# EasyEDA schematic Geiger counter.json
TITLE: Sheet_1; REV: 1.0; Date: 2019-12-27; Sheet: 1/1; Drawn By: bananatrek; Company: Your Company
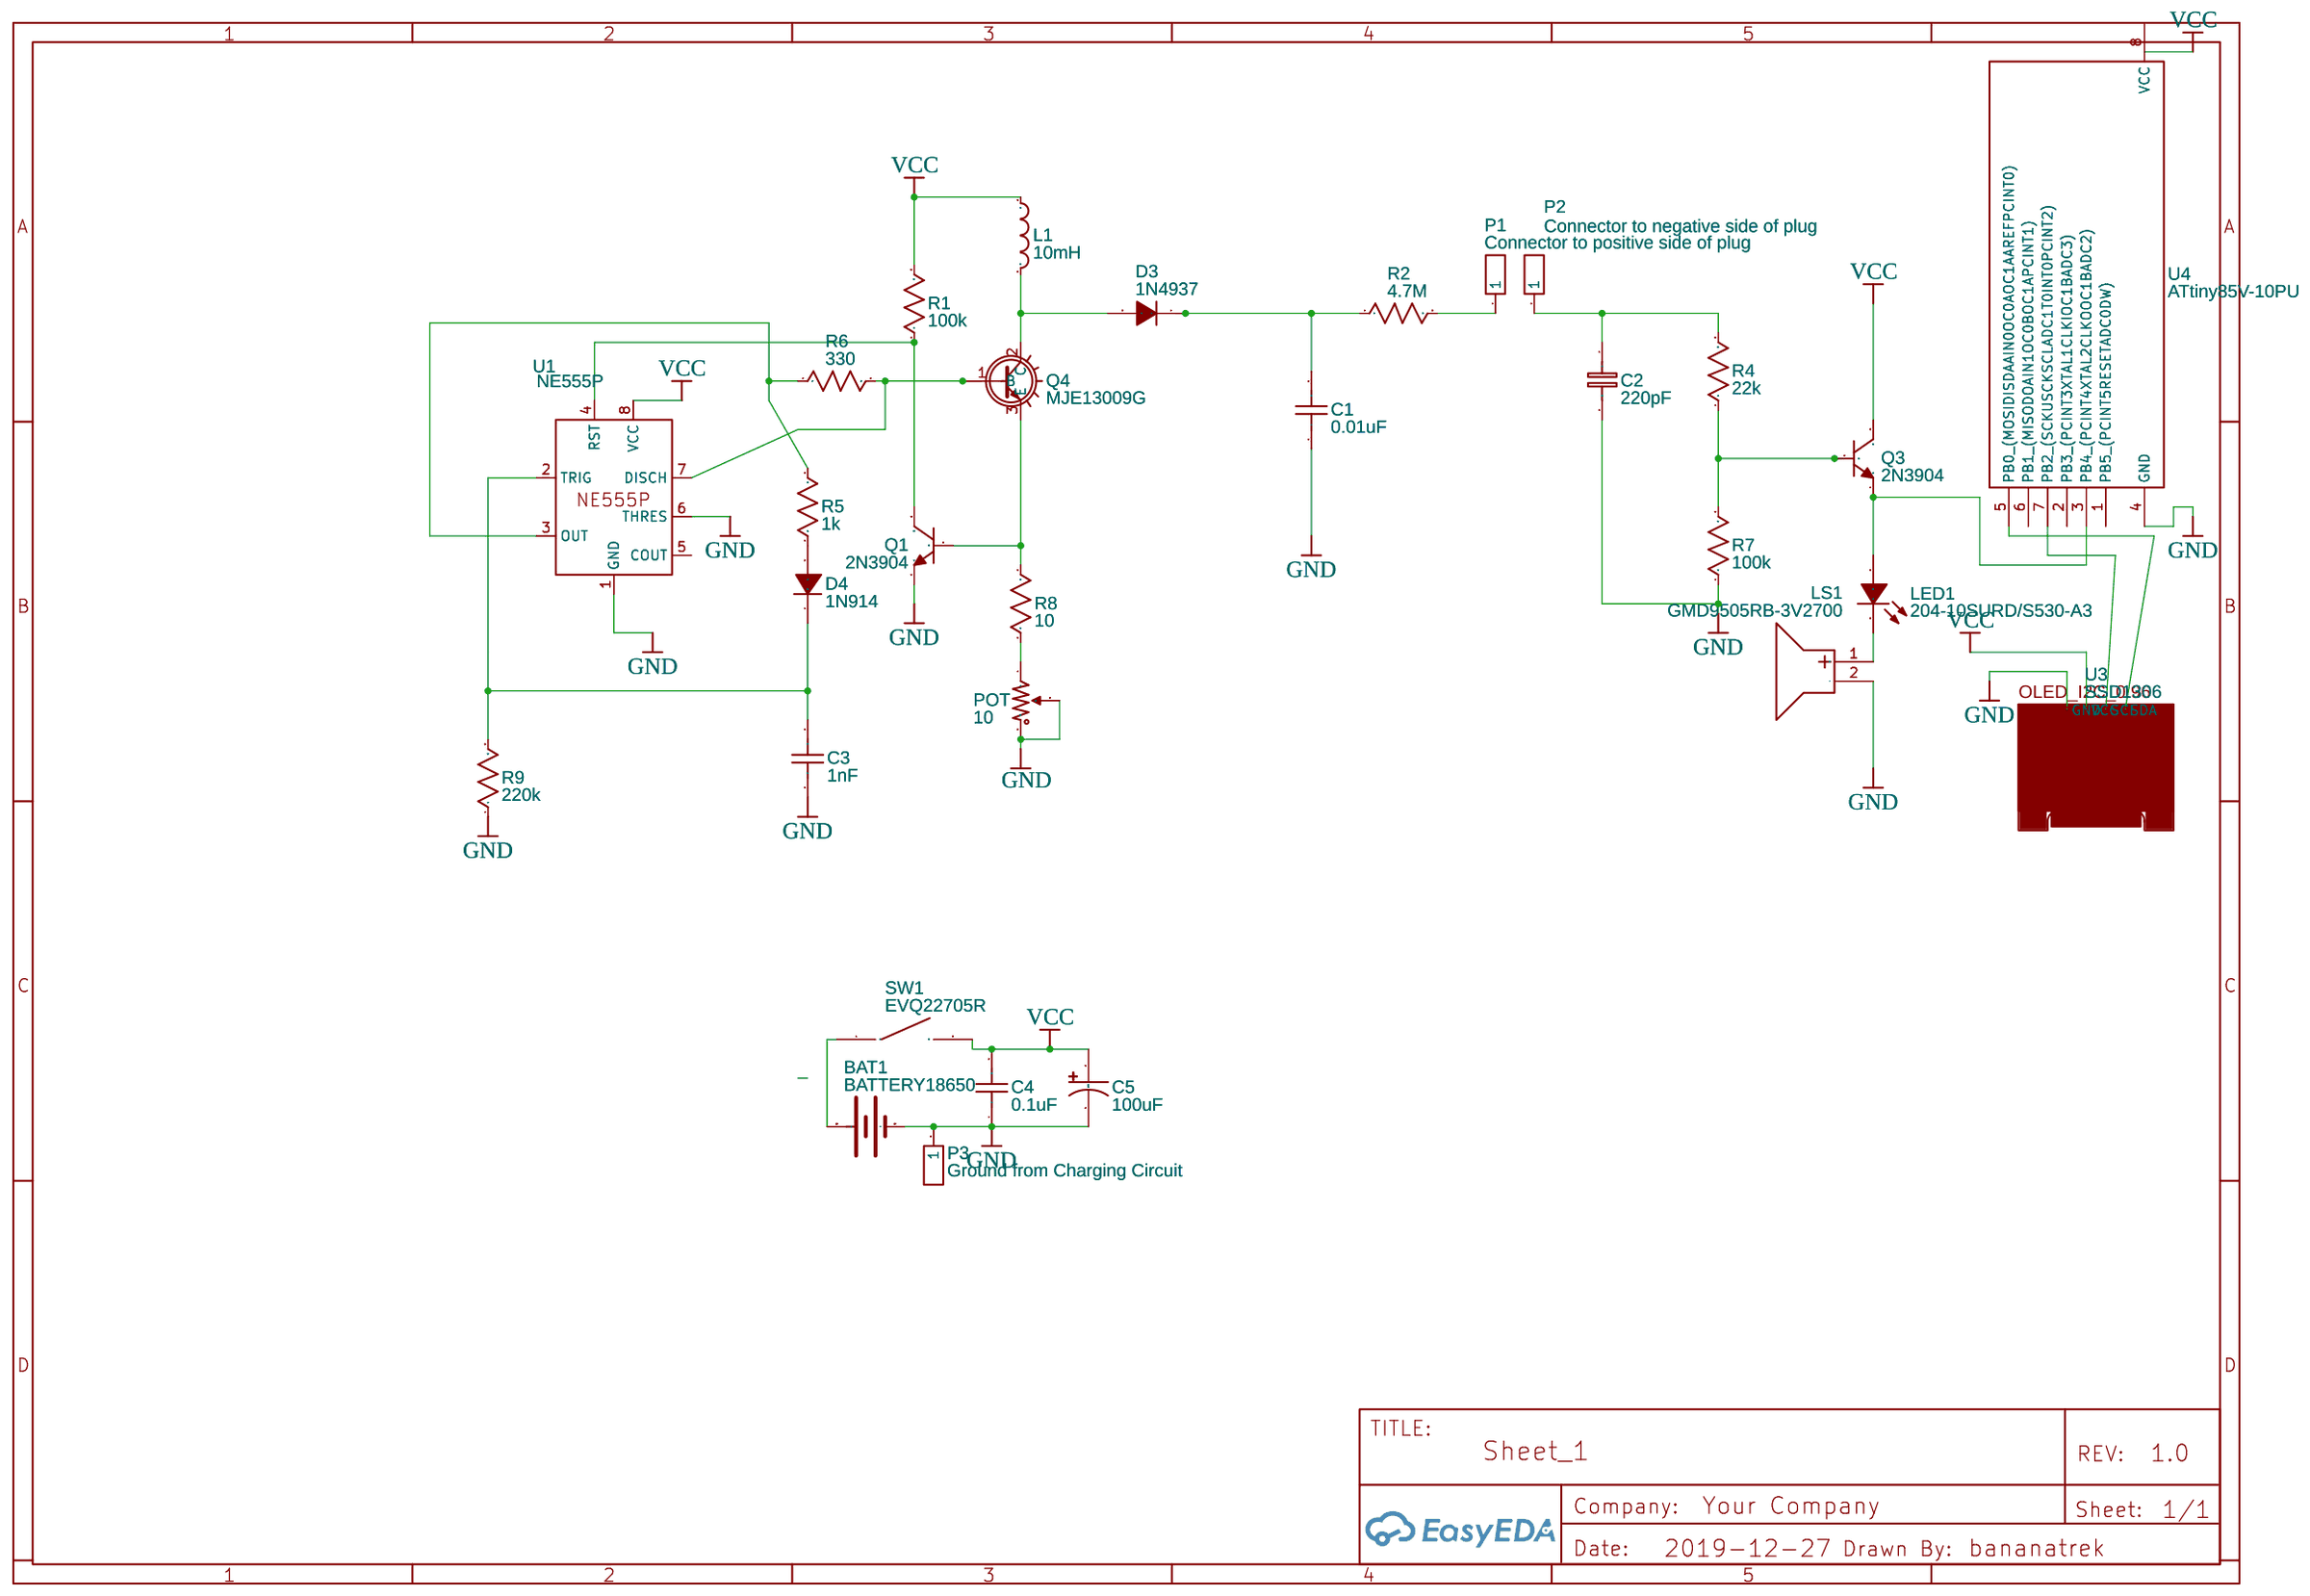
[diagram p0: schematic sheet]

## Parts
BAT1  BATTERY18650  [BATTERY_18650-HOLDER]
C1  0.01uF  [RAD-0.1]
C2  220pF  [RAD-0.1]
C3  1nF  [RAD-0.1]
C4  0.1uF  [RAD-0.1]
C5  100uF  [CAP-D3.0XF1.5]
D3  1N4937  [DO-41_BD2.4-L4.7-P8.70-D0.9-RD]
D4  1N914  [DO-35_BD2.0-L4.2-P8.20-D0.5-RD]
L1  10mH  [AXIAL-0.4]
LED1  204-10SURD/S530-A3  [LED-3MM/2.54]
LS1  GMD9505RB-3V2700  [BUZZER-TH_2PIN_GMD9505RB-3V2700]
P1  Connector to positive side of plug  [HDR-1X1/2.54]
P2  Connector to negative side of plug  [HDR-1X1/2.54]
P3  Ground from Charging Circuit  [HDR-1X1/2.54]
POT  10  [RES-ADJ_3296W]
Q1  2N3904  [TO-92(TO-92-3)]
Q3  2N3904  [TO-92(TO-92-3)]
Q4  MJE13009G  [TO220]
R1  100k  [AXIAL-0.3]
R2  4.7M  [AXIAL-0.3]
R4  22k  [AXIAL-0.3]
R5  1k  [AXIAL-0.3]
R6  330  [AXIAL-0.3]
R7  100k  [AXIAL-0.3]
R8  10  [AXIAL-0.3]
R9  220k  [AXIAL-0.3]
SW1  EVQ22705R  [KEY-6.0*6.0-4]
U1  NE555P  [DIP-8_L9.8-W6.6-P2.54-LS7.6-BL]
U3  SSD1306  [SSD1306]
U4  ATtiny85V-10PU  [DIP8]

## Library data of the parts
BAT1 = -: Battery Holders; Contributor: SparkFun
C1 C3 C4 = Cap_RAD-0.1_US
C2 = Cap_RAD-0.1_EU
C5 = Cap_Electrolytic(TH)_D3.0XF1.5_US
D3 = -: Supplier: LCSC; Supplier Part: C237246; Manufacturer: HL; Contributor: LCSC
D4 = -: Supplier: LCSC; Manufacturer: FAIRCHILD; Supplier Part: C96325
L1 = Inductor_AXIAL-0.4_US
LED1 = -: Supplier: LCSC; Manufacturer: EVERLIGHT; Supplier Part: C99772
LS1 = -: Supplier: LCSC; Supplier Part: C252935; Manufacturer: INGHAi; Contributor: LCSC
P1-P3 = -: Supplier: LCSC; Manufacturer: ReliaPro; Manufacturer Part: Header-Male-2.54_1x1; Supplier Part: C81276
POT = Potentiometer: K(%): 50
Q1 Q3 = -: Supplier: LCSC; Manufacturer: SEMTECH; Supplier Part: C118538
Q4 = -: Contributor: KiCad
R1 R2 R4-R9 = Res_AXIAL-0.3(1/8W)_US
SW1 = -: Supplier: LCSC; Manufacturer: PANASONIC; Contributor: LCSC; Supplier Part: C79156
U1 = -: Supplier: LCSC; Manufacturer: TI; image: //image.lceda.cn/szlcsc/C46749.jpg; Supplier Part: C46749
U3 = -: Contributor: Munkh
U4 = -: 8-bit AVR Microcontroller, 10MHz, 1.8-5.5V, 8K Flash, 512 Bytes EEPROM, 512 Bytes SRAM, Industrial Grade (-40u7648 to 85u7648), 8-Lead PDIP, Pb-Free

## Nets
GND: BAT1.GND@1(-) C1.1 C2.2 C3.1 C4.1 C5.2 LS1.2(-) P3.1 POT.2(3) POT.3(2) Q1.1(E) R7.1 R9.1 U1.1(GND) U1.6(THRES) U3.1(GND) U4.4(GND)
VCC: C4.2 C5.1 L1.1 Q3.3(C) R1.2 SW1.2 U1.8(VCC) U3.2(VCC)
Net-(BAT1-PWR@1): BAT1.PWR@1(+) SW1.1
Net-(C1-2): C1.2 D3.1(K) R2.1
Net-(C2-1): C2.1 P2.1 R4.2
Net-(C3-2): C3.2 D4.1(K) R9.2 U1.2(TRIG)
Net-(D3-2): D3.2(A) L1.2 Q4.2(C)
Net-(D4-2): D4.2(A) R5.1
Net-(LED1-1): LED1.1(A) Q3.1(E) U4.3(PB4 (PCINT4XTAL2CLKOOC1BADC2))
Net-(LED1-2): LED1.2(K) LS1.1(+)
Net-(P1-1): P1.1 R2.2
Net-(POT-1): POT.1 R8.1
Net-(Q1-2): Q1.2(B) Q4.3(E) R8.2
Net-(Q1-3): Q1.3(C) R1.1 U1.4(RST)
Net-(Q3-2): Q3.2(B) R4.1 R7.2
Net-(Q4-1): Q4.1(B) R6.2 U1.7(DISCH)
Net-(R5-2): R5.2 R6.1 U1.3(OUT)
Net-(U3-3): U3.3(SDA) U4.5(PB0 (MOSIDISDAAIN0OC0AOC1AAREFPCINT0))
Net-(U3-4): U3.4(SCL) U4.7(PB2 (SCKUSCKSCLADC1T0INT0PCINT2))

Not connected (* = marked no-connect by the designer): U1 5(COUT); U4 1(PB5 (PCINT5RESETADC0DW)) 2(PB3 (PCINT3XTAL1CLKIOC1BADC3)) 6(PB1 (MISODOAIN1OC0BOC1APCINT1)) 8(VCC)
